# EAGLE design MySensors_AirQuality_Board_2017-11-14_AutoRoutingAfterManual (EAGLE 8.3.2)
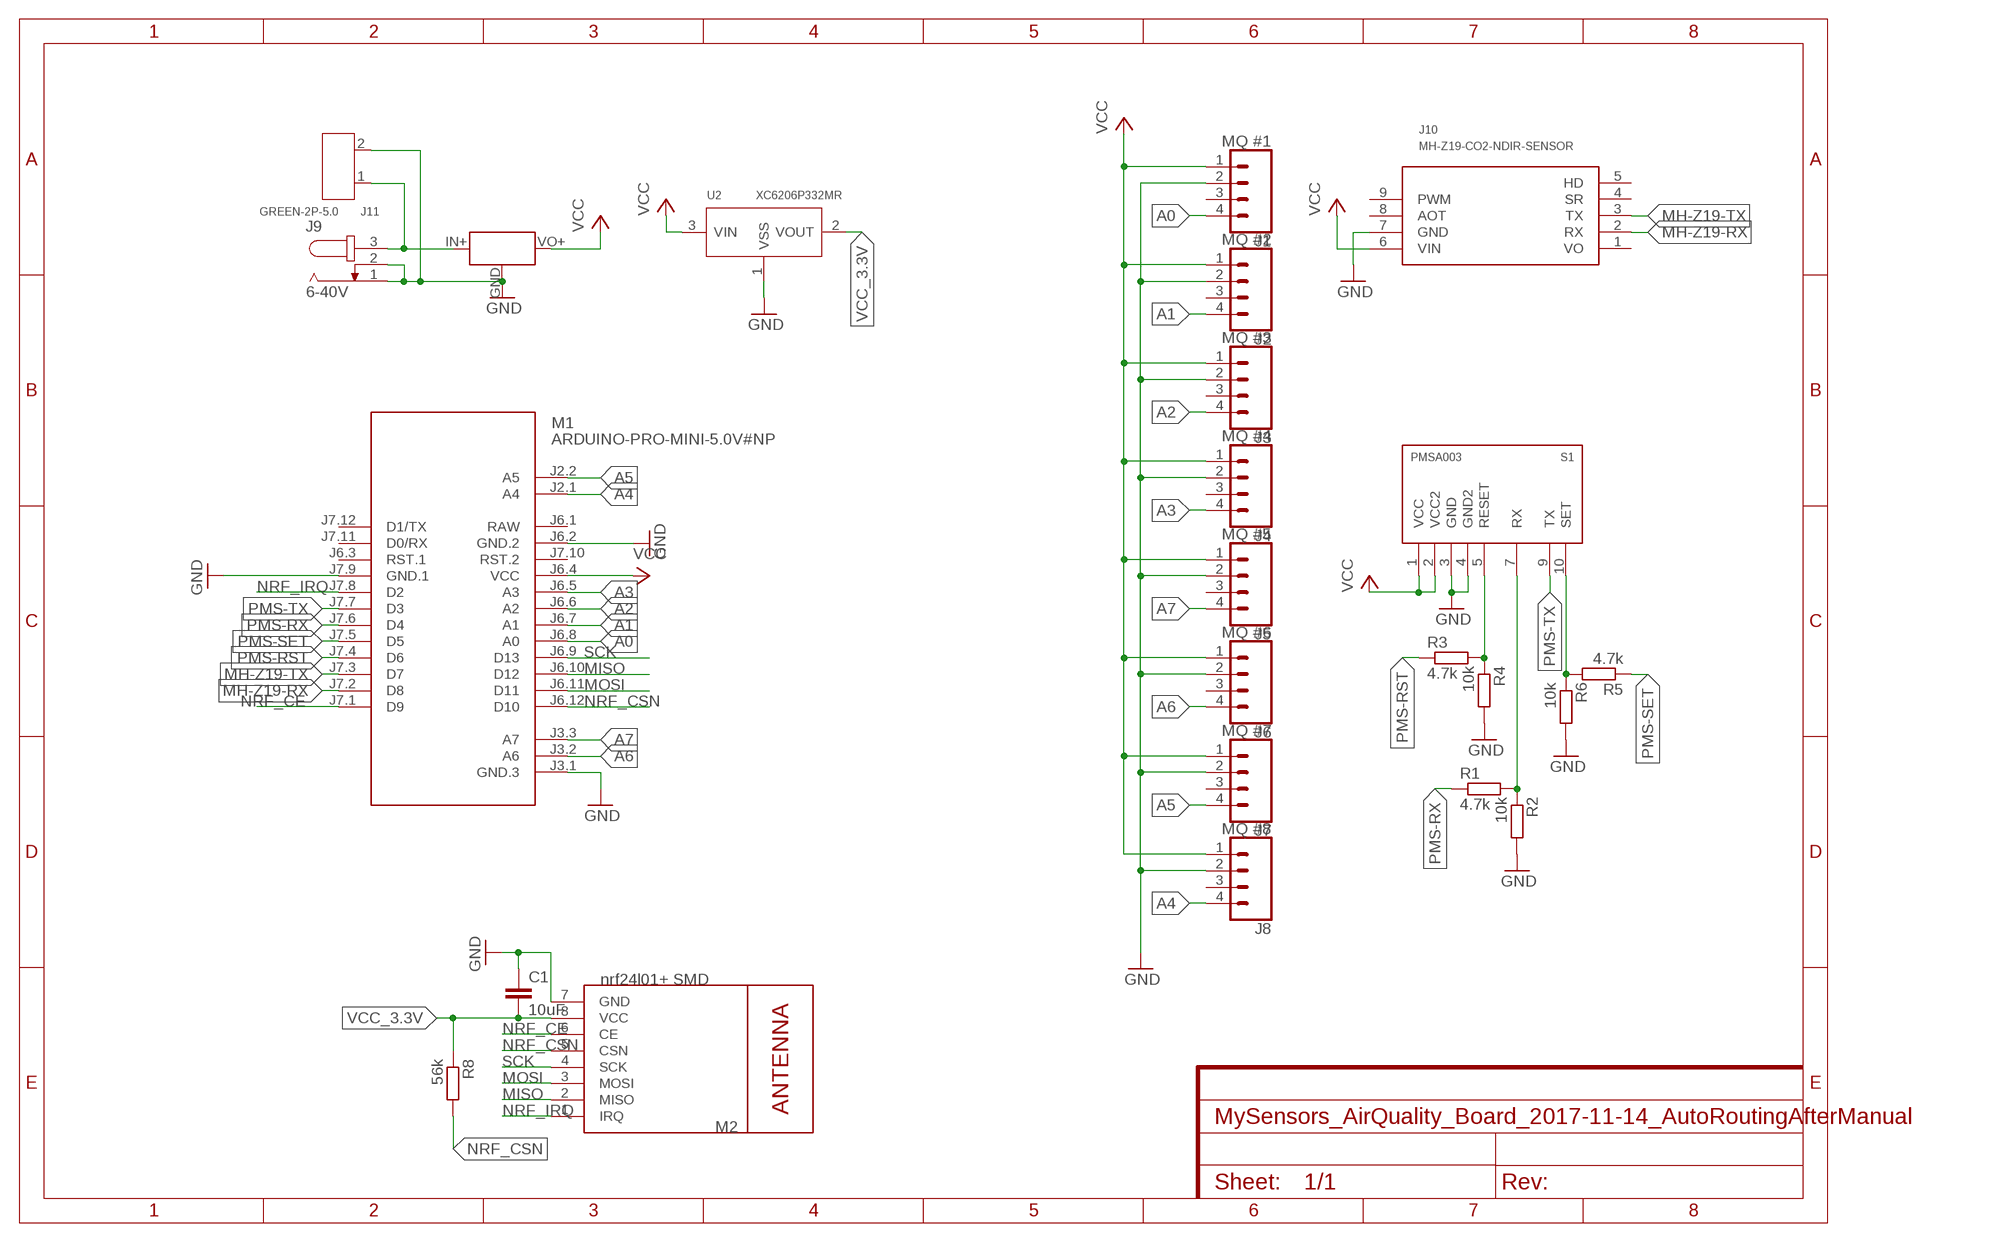
[diagram p0: schematic, sheet 1]
FRAME1 (FRAME-A4L): CNAME: MySensors AirQuality Board; CREVISION: 0.01; DESIGNER: R. Kainhofer, 2017-11-03

## Parts
C1  10uF  C-EUC0805  [C0805]
J1  MQ #1  CONN_04  [1X04]
J2  MQ #2  CONN_04  [1X04]
J3  MQ #3  CONN_04  [1X04]
J4  MQ #4  CONN_04  [1X04]
J5  MQ #5  CONN_04  [1X04]
J6  MQ #6  CONN_04  [1X04]
J7  MQ #7  CONN_04  [1X04]
J8  MQ #8  CONN_04  [1X04]
J9  6-40V  JACK-PLUG1  [SPC4078]
J10  MH-Z19-CO2-NDIR-SENSOR  [MH-Z19]
J11  GREEN-2P-5.0  SCREW-TERMINAL-GREEN(2P-5.0)  [H2-5.0-10.5X8.0MM]
M1  ARDUINO-PRO-MINI-5.0V#NP  [ARDUINO-PRO-MINI#NP]
M2  nrf24l01+ SMD  WIRELESS-NRF24L01SMD  [WIRELESS-NRF24L01-SMD]
R1  4.7k  R-EU_R0805  [R0805]
R2  10k  R-EU_R0805  [R0805]
R3  4.7k  R-EU_R0805  [R0805]
R4  10k  R-EU_R0805  [R0805]
R5  4.7k  R-EU_R0805  [R0805]
R6  10k  R-EU_R0805  [R0805]
R8  56k  R-EU_R0805  [R0805]
S1  PMSA003  [PMSA003]
U2  XC6206P332MR  PMIC-LDO-XC6206P332MR-G(SOT23)  [SOT-23]
U$2  MINI_BUCK_CONVERTER  [MINI_BUCK_CONVERTER]

## Nets
A0: J1.4 M1.J6.8(A0)
A1: J2.4 M1.J6.7(A1)
A2: J3.4 M1.J6.6(A2)
A3: J4.4 M1.J6.5(A3)
A4: J8.4 M1.J2.1(A4)
A5: J7.4 M1.J2.2(A5)
A6: J6.4 M1.J3.2(A6)
A7: J5.4 M1.J3.3(A7)
GND: C1.1 J1.2 J2.2 J3.2 J4.2 J5.2 J6.2 J7.2 J8.2 J9.1 J9.2 J10.7(GND) J11.2 M1.J3.1(GND.3) M1.J6.2(GND.2) M1.J7.9(GND.1) M2.7(GND) R2.2 R4.2 R6.2 S1.3(GND) S1.4(GND2) U2.1(VSS) U$2.GND
MH-Z19-RX: J10.2(RX) M1.J7.2(D8)
MH-Z19-TX: J10.3(TX) M1.J7.3(D7)
MISO: M1.J6.10(D12) M2.2(MISO)
MOSI: M1.J6.11(D11) M2.3(MOSI)
N$2: J9.3 J11.1 U$2.IN+(VIN)
NRF_CE: M1.J7.1(D9) M2.6(CE)
NRF_CSN: M1.J6.12(D10) M2.5(CSN) R8.2
NRF_IRQ: M1.J7.8(D2) M2.1(IRQ)
PMS-RESET-3.3V: R3.2 R4.1 S1.5(RESET)
PMS-RST: M1.J7.4(D6) R3.1
PMS-RX: M1.J7.6(D4) R1.1
PMS-RX-3.3V: R1.2 R2.1 S1.7(RX)
PMS-SET: M1.J7.5(D5) R5.1
PMS-SET_3.3V: R5.2 R6.1 S1.10(SET)
PMS-TX: M1.J7.7(D3) S1.9(TX)
SCK: M1.J6.9(D13) M2.4(SCK)
VCC: J1.1 J2.1 J3.1 J4.1 J5.1 J6.1 J7.1 J8.1 J10.6(VIN) M1.J6.4(VCC) S1.1(VCC) S1.2(VCC2) U2.3(VIN) U$2.VO+(VOUT)
VCC_3.3V: C1.2 M2.8(VCC) R8.1 U2.2(VOUT)
Unconnected: J1.3 J2.3 J3.3 J4.3 J5.3 J6.3 J7.3 J8.3 J10.4(SR) J10.5(HD) J10.8(AOT) J10.9(PWM) M1.J6.3(RST.1) M1.J7.10(RST.2) M1.J7.11(D0/RX) M1.J7.12(D1/TX)

## Power pins joined to a net without a drawn wire
RAW: M1.J6.1(RAW)
VO: J10.1(VO)

## Library data of the parts
C1 = rcl:C-EU: CAPACITOR, European symbol
J1-J8 = SparkFun-Connectors:CONN_04: Multi connection point. Often used as Generic Header-pin footprint for 0.1 inch spaced/style header connections On any of the 0.1 inch spaced packages, you can populate with these: Break Away Headers - Straight <https://www.sparkfun.com/products/116> (PRT-00116) Break Away Male Headers - Right Angle <https://www.sparkfun.com/products/553> (PRT-00553) Female Headers <https://www.sparkfun.com/products/115> (PRT-00115) Break Away Headers - Machine Pin <https://www.sparkfun.com/products/117> (PRT-00117) Break Away Female Headers - Swiss Machine Pin <https://www.sparkfun.com/products/743> (PRT-00743) For SCREWTERMINALS and SPRING TERMINALS visit here: Screw Terimnals on SparkFun.com <https://www.sparkfun.com/search/results?term=Screw+Terminals> (5mm/3.5mm/2.54mm spacing) This device is also useful as a general connection point to wire up your design to another part of your project. Our various solder wires solder well into these plated through hole pads. Hook-Up Wire - Assortment (Stranded, 22 AWG) <https://www.sparkfun.com/products/11375> (PRT-11375) Hook-Up Wire - Assortment (Solid Core, 22 AWG) <https://www.sparkfun.com/products/11367> (PRT-11367) View the entire wire category on our website here <https://www.sparkfun.com/categories/141> Special notes: Molex polarized connector foot print use with SKU : PRT-08231 with associated crimp pins and housings. 1MM SMD Version SKU: PRT-10208; PROD_ID: CONN-09696
J9 = con-jack:JACK-PLUG: DC POWER JACK Power Jack, DC, Right Angle, Through Hole, Rated 5A at 16VDC, PC Terminals Distributor: Farnell (www.Farnell.de) Drawing: 84N1161.pdf / 84N1162.pdf Manufacturer: SPC Technology (www.spctechnology.com) Type: SPC4077 / SPC 4078; OC_FARNELL: unknown; OC_NEWARK: unknown
J10 = mh-z19:MH-Z19: MH-Z19 - CO2 NDIR SENSOR
J11 = Seeed-Connector:SCREW-TERMINAL-GREEN(2P-5.0): 320110031
M1 = diy-modules:ARDUINO-PRO-MINI-*#NP: Arduino Pro Mini (and compatible devices) without programming pads More details available here: https://www.arduino.cc/en/Main/ArduinoBoardProMini Click here to find device on ebay.com <http://www.ebay.com/sch/arduino+pro+mini>
M2 = nrf24l01plus:WIRELESS-NRF24L01: 2.4 GHz Wireless Module based on NRF24L01 chip
R1-R6 = resistor:R-EU_: RESISTOR, European symbol
R8 = rcl:R-EU_: RESISTOR, European symbol
S1 = opentools-sensors:PMS: PLANTOWER PMSx003 Laser PM2.5 Dust Sensor
U2 = Seeed-IC:PMIC-LDO-XC6206P332MR-G(SOT23): 310030099; MPN: XC6206P332MR-G; VALUE: XC6206P332MR-G-SOT23
U$2 = opentools-sensors:MINI_BUCK_CONVERTER: 4.5-40V Step Down Buck Converter

## Net classes
0 default: width 0.305 mm, clearance 0.203 mm

## Board
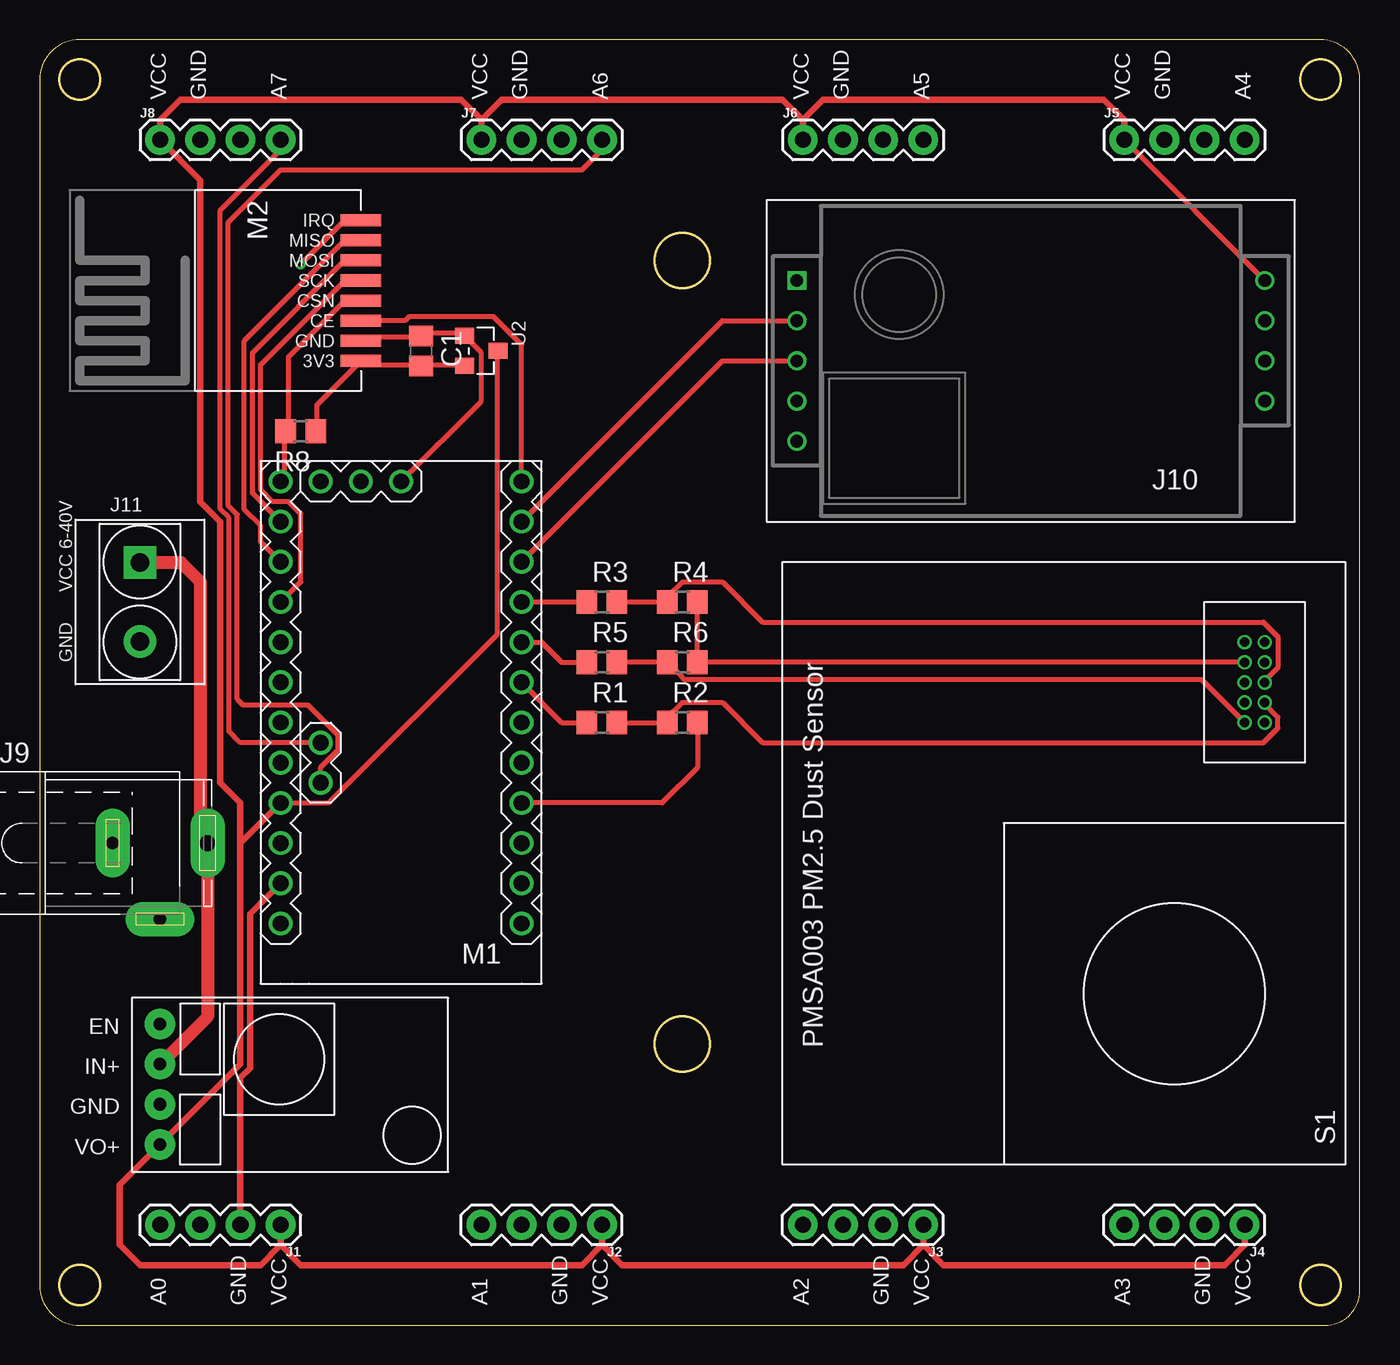
[diagram p1: board, top side]
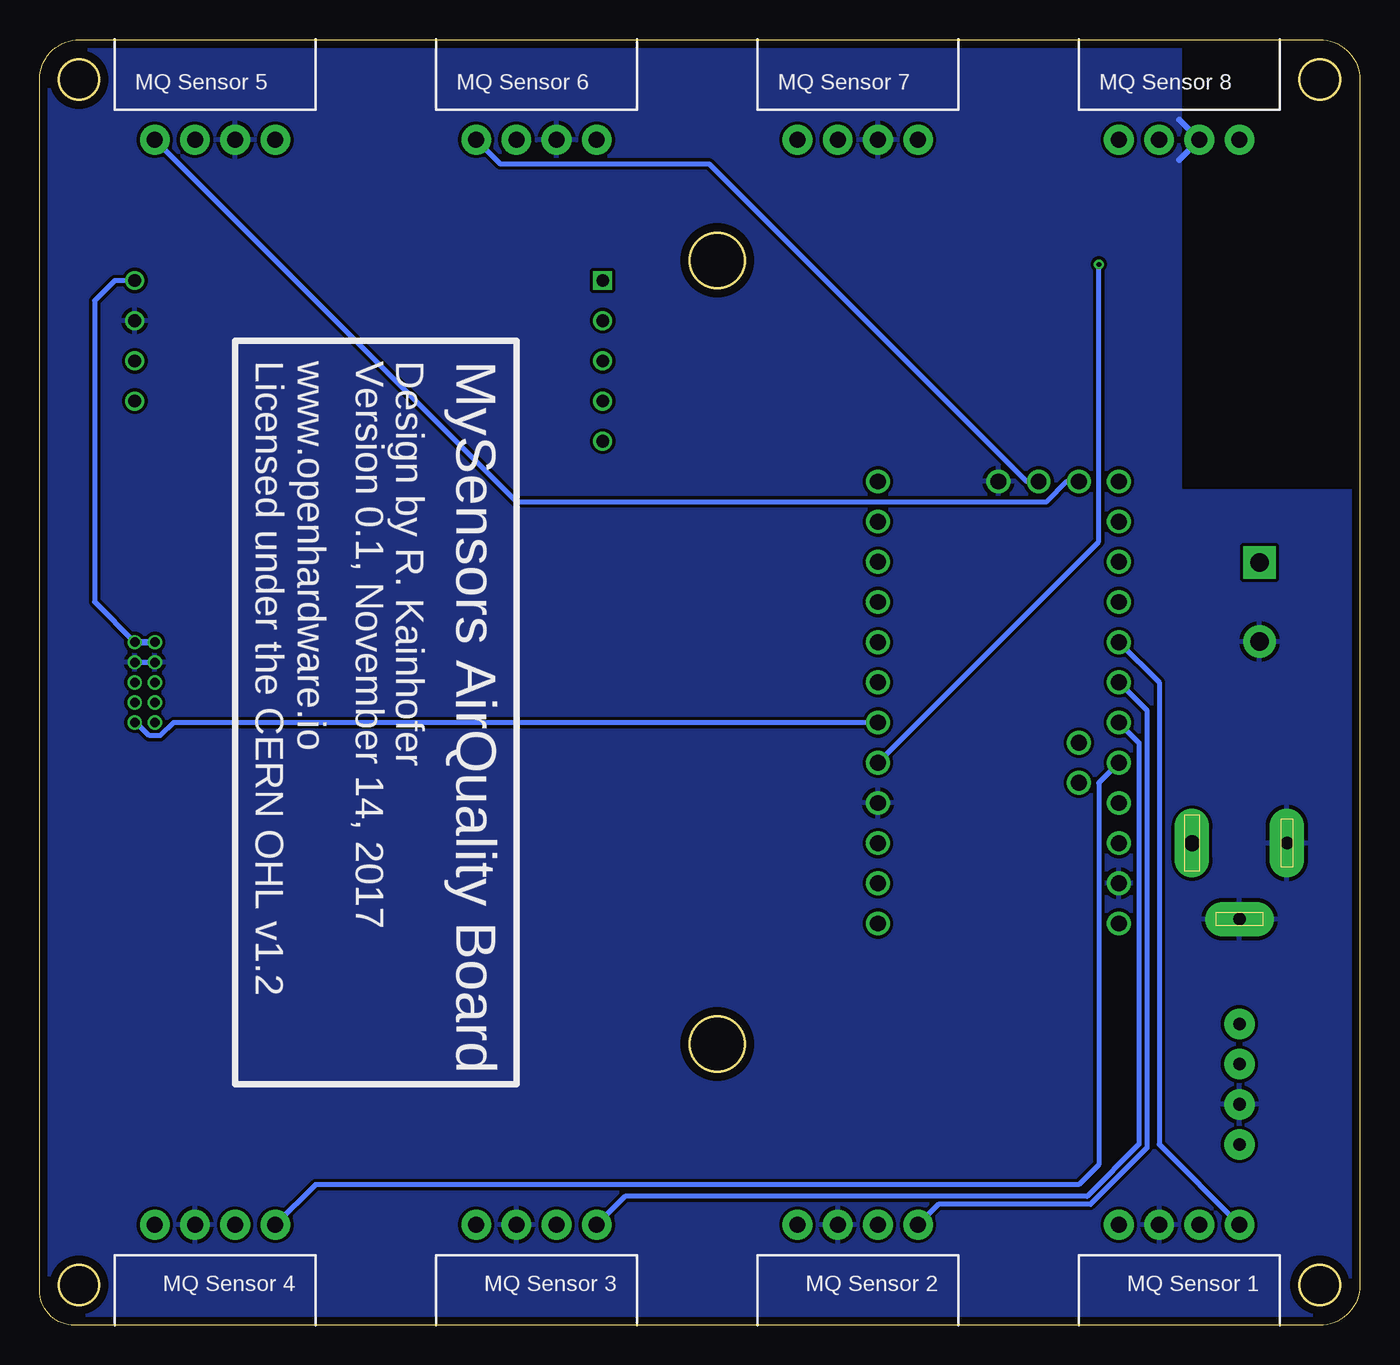
[diagram p2: board, bottom side, seen from below]

Size 83.49 x 81.27 mm. Coordinates in mm from the lower left corner, seen from the top.
Outline: 0,78.73 0,2.54 arc90 2.54,0 81.28,0 arc90 83.49,2.21 83.49,78.74 arc90 80.96,81.27 2.54,81.27 arc90 0,78.73
Outline: circle at 2.54,78.74 radius 1.27
Outline: circle at 2.54,2.54 radius 1.27
Outline: circle at 81,2.54 radius 1.27
Outline: circle at 81,78.74 radius 1.27
Outline: circle at 40.64,67.31 radius 1.75
Outline: circle at 40.64,17.78 radius 1.75
Copper layers (1*16): Top 0.035mm / dielectric 1.6mm / Bottom 0.035mm
Design rules "Elecrow_2-layer_PCB_eagle_rule": minimum track width 6mil, minimum drill 12mil, track to track 6mil, track to pad 6mil, pad to pad 6mil, via to via 8mil, smd to smd 0mil, copper to edge 20mil, drill to drill 10mil, minimum pad ring 6mil, minimum via ring 6mil, stop-mask expansion 0mil, vias tented up to drill 100mil, thermal gap 10mil

### Footprints (pad centres in the part's own frame; a part is rotated, then mirrored left to right if it is on the bottom)
C0805 = smd 1.3 x 1.5: 1 -0.95,0; 2 0.95,0
1X04 = drill 1.016 pad 1.88: 1 0,0; 2 2.54,0; 3 5.08,0; 4 7.62,0
SPC4078 = drill 0.8 pad 2.184 long: 1 -3,0; 2 0,-4.8 | drill 1 pad 2.184 long: 3 3,0
MH-Z19 = drill 0.8 square: 1 29.591,0 | drill 0.8: 2 29.591,2.54; 3 29.591,5.08; 4 29.591,7.62; 5 29.591,10.16; 6 0,0; 7 0,2.54; 8 0,5.08; 9 0,7.62
H2-5.0-10.5X8.0MM = drill 1.168 pad 2.032 square: 1 0,2.5 | drill 1.168 pad 2.032: 2 0,-2.5
ARDUINO-PRO-MINI#NP = drill 1: J2.1 -1.27,5.08; J2.2 -3.81,5.08; J3.1 15.24,0; J3.2 15.24,2.54; J3.3 15.24,5.08; J6.1 -12.7,7.62; J6.2 -10.16,7.62; J6.3 -7.62,7.62; J6.4 -5.08,7.62; J6.5 -2.54,7.62; J6.6 0,7.62; J6.7 2.54,7.62; J6.8 5.08,7.62; J6.9 7.62,7.62; J6.10 10.16,7.62; J6.11 12.7,7.62; J6.12 15.24,7.62; J7.1 15.24,-7.62; J7.2 12.7,-7.62; J7.3 10.16,-7.62; J7.4 7.62,-7.62; J7.5 5.08,-7.62; J7.6 2.54,-7.62; J7.7 0,-7.62; J7.8 -2.54,-7.62; J7.9 -5.08,-7.62; J7.10 -7.62,-7.62; J7.11 -10.16,-7.62; J7.12 -12.7,-7.62
WIRELESS-NRF24L01-SMD = smd 2.54 x 0.762: 1 1.27,0; 2 1.27,1.27; 3 1.27,2.54; 4 1.27,3.81; 5 1.27,5.08; 6 1.27,6.35; 7 1.27,7.62; 8 1.27,8.89
R0805 = smd 1.3 x 1.5: 1 -0.95,0; 2 0.95,0
PMSA003 = drill 0.6: 1 5.08,-5.08; 2 5.08,-6.35; 3 6.35,-5.08; 4 6.35,-6.35; 5 7.62,-5.08; 6 7.62,-6.35; 7 8.89,-5.08; 8 8.89,-6.35; 9 10.16,-5.08; 10 10.16,-6.35
SOT-23 = smd 1.016 x 1.2: 1 -0.95,-1.06; 2 0.95,-1.06; 3 0,1.06
MINI_BUCK_CONVERTER = drill 0.8 pad 1.93: EN 1.27,1.27; GND 6.35,1.27; IN+ 3.81,1.27; VO+ 8.89,1.27

### Placement (x,y rotation side)
C1  24.13,61.6 270 top
J1  15.24,6.35 180 top
J2  35.56,6.35 180 top
J3  55.88,6.35 180 top
J4  76.2,6.35 180 top
J5  68.58,74.93 0 top
J6  48.26,74.93 0 top
J7  27.94,74.93 0 top
J8  7.62,74.93 0 top
J9  7.62,30.48 0 top
J10  77.47,66.04 180 top
J11  6.35,45.72 0 top
M1  22.86,38.1 90 top
M2  21.59,69.85 180 top
R1  35.56,38.1 0 top
R2  40.64,38.1 0 top
R3  35.56,45.72 0 top
R4  40.64,45.72 0 top
R5  35.56,41.91 0 top
R6  40.64,41.91 0 top
R8  16.51,56.52 180 top
S1  82.55,48.26 270 top
U2  27.94,61.6 270 top
U$2  6.35,20.32 270 top

### Tracks (layer width: path | path; a pad name or v marks a point on that pad's centre or on a via)
A0
  Bottom 0.305: M1.J6.8 12.7,40.64 12.7,11.43 J1.4
A1
  Bottom 0.305: M1.J6.7 13.46,38.86 13.46,11.22 17.04,7.64 26.64,7.64 J2.4
A2
  Bottom 0.305: M1.J6.6 13.97,36.83 13.97,11.43 17.25,8.15 46.46,8.15 J3.4
A3
  Bottom 0.305: M1.J6.5 16.51,34.29 16.51,10.16 17.78,8.89 66.04,8.89 J4.4
A4
  Top 0.305: M1.J2.1 12.7,36.83 11.99,37.54 11.99,51.03 11.43,51.59 11.43,70.48 15.24,74.3 J8.4
A5
  Top 0.305: M1.J2.2 17.78,35.27 18.89,36.37 18.89,37.29 16.97,39.21 12.86,39.21 12.5,39.57 12.5,51.24 11.94,51.8 11.94,69.72 15.24,73.02 34.29,73.02 35.56,74.3 J7.4
A6
  Bottom 0.305: M1.J3.2 21.08,53.34 41.15,73.41 54.36,73.41 J6.4
A7
  Bottom 0.305: M1.J3.3 18.54,53.34 19.81,52.07 53.34,52.07 J5.4
GND
  Top 0.305: R4.2 R6.2 S1.4 | R2.2 41.59,35.24 39.37,33.02 M1.J7.9 | 26.92,62.74 U2.1 | U2.1 26.67,62.74 24.13,62.74 C1.1 24.13,62.48 20.57,62.48 M2.7 | M1.J3.1 27.94,58.42 27.94,61.47 26.92,62.48 U2.1
  Top 0.406: J1.2 12.7,15.65 13.31,16.26 13.31,26.01 M1.J6.2
  Bottom 0.305: S1.3 S1.4
  Bottom 0.406: 7.9,25.4 J9.2 | 11.43,73.66 J8.2 11.43,76.2
  pour Bottom: 0,0 83.82,0 83.82,81.28 11.43,81.28 11.43,52.71 0,52.71
MH-Z19-RX
  Top 0.305: J10.2 43.18,63.5 M1.J7.2
MH-Z19-TX
  Top 0.305: J10.3 43.18,60.96 M1.J7.3
MISO
  Top 0.305: M2.2 19.3,68.58 12.95,62.23 12.95,51.56 13.97,50.55 13.97,49.53 M1.J6.10
MOSI
  Top 0.305: M2.3 19.3,67.31 13.46,61.47 13.46,52.58 M1.J6.11
N$2
  Top 0.813: J11.1 8.93,48.22 10.16,46.99 10.16,30.94 J9.3 10.62,19.51 U$2.IN+
NRF_CE
  Top 0.305: M2.6 23.11,63.5 23.37,63.75 28.7,63.75 30.48,61.98 M1.J7.1
NRF_CSN
  Top 0.305: M1.J6.12 15.49,53.59 15.49,56.39 R8.2 15.75,56.64 15.75,61.21 19.3,64.77 M2.5
NRF_IRQ  (via drill 0.3)
  Top 0.305: M2.1 19.3,69.85 v16.51,67.06
  Bottom 0.305: v16.51,67.06 16.51,49.53 M1.J7.8
PMS-RESET-3.3V
  Top 0.305: R3.2 R4.1 | 39.69,46.04 40.64,46.99 43.18,46.99 45.72,44.45 77.38,44.45 78.3,43.53 78.3,41.57 77.47,40.73 S1.5
  Top 0.406: R4.1 39.69,46.04
PMS-RST
  Top 0.305: M1.J7.4 R3.1
PMS-RX
  Top 0.305: M1.J7.6 33.02,38.1 R1.1
PMS-RX-3.3V
  Top 0.305: R1.2 R2.1 39.8,38.1 | S1.7 77.47,39.28 78.3,38.45 78.3,37.76 77.38,36.83 45.72,36.83 43.18,39.37 40.64,39.37 39.69,38.42
  Top 0.406: R2.1 39.69,38.42
PMS-SET
  Top 0.305: M1.J7.5 31.75,43.18 33.02,41.91 R5.1
PMS-SET_3.3V
  Top 0.305: R6.1 R5.2 | R6.1 39.8,41.91 | R6.1 40.58,41.02 40.58,41.01 40.79,40.8 73.5,40.8 S1.10
PMS-TX
  Bottom 0.305: M1.J7.7 75.02,38.1 75.86,37.27 76.55,37.27 77.38,38.1 S1.9
SCK
  Top 0.305: M2.4 19.3,66.04 13.97,60.71 13.97,52.83 14.73,52.07 15.75,52.07 16.51,51.31 16.51,46.99 M1.J6.9
VCC
  Top 0.305: 29.21,61.72 U2.3 28.96,61.47 28.96,43.69 18.29,33.02 M1.J6.4 | J5.1 J10.6
  Top 0.406: M1.J6.4 12.7,30.48 | 12.7,30.48 12.7,16.51 U$2.VO+ 5.08,8.89 5.08,5.08 6.35,3.81 13.97,3.81 15.24,5.08 | 12.7,30.48 12.7,33.02 11.43,34.29 11.43,50.8 10.16,52.07 10.16,72.39 J8.1 7.62,76.2 8.89,77.47 26.67,77.47 27.94,76.2 | J1.1 15.24,5.08 | 15.24,5.08 16.51,3.81 34.29,3.81 35.56,5.08 | J2.1 35.56,5.08 | 35.56,5.08 36.83,3.81 54.61,3.81 55.88,5.08 | 55.88,5.08 J3.1 | 55.88,5.08 57.15,3.81 74.93,3.81 76.2,5.08 J4.1 | 27.94,76.2 J7.1 | 27.94,76.2 29.21,77.47 46.99,77.47 48.26,76.2 | 48.26,76.2 J6.1 | 48.26,76.2 49.53,77.47 67.31,77.47 68.58,76.2 J5.1
  Bottom 0.305: J10.6 78.74,66.04 80.01,64.77 80.01,45.72 S1.1
  Bottom 0.406: S1.1 S1.2
VCC_3.3V
  Top 0.305: 24.13,60.71 26.67,60.71 U2.2 | 20.07,60.71 17.53,58.17 17.53,56.64 R8.1 | 20.07,60.71 24.13,60.71 | 24.13,60.71 C1.2 | 20.07,60.71 M2.8

### Text on the board
tPlace: VCC / GND / / A7 | VCC / GND / / A6 | VCC / GND / / A5 | VCC / GND / / A4 | VCC 6-40V | GND | EN / IN+ / GND / VO+ | A0 / / GND / VCC | A1 / / GND / VCC | A2 / / GND / VCC | A3 / / GND / VCC
bPlace: MQ Sensor 8 | MQ Sensor 7 | MQ Sensor 6 | MQ Sensor 5 | MySensors AirQuality Board | Design by R. Kainhofer | Version 0.1, November 14, 2017 | www.openhardware.io / Licensed under the CERN OHL v1.2 | MQ Sensor 1 | MQ Sensor 2 | MQ Sensor 3 | MQ Sensor 4